# Altium schematic sheet ALS.SchDoc
size A
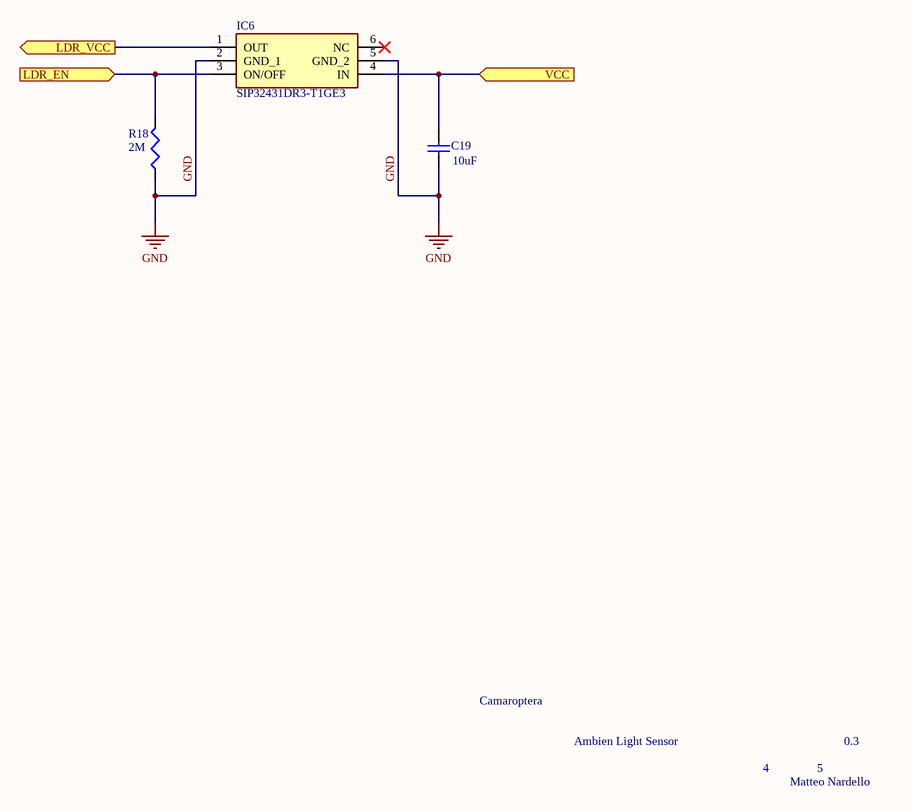
[diagram p0: ALS.SchDoc]

## Parts
C19  value 10uF  [1608[0603]]  (hidden comment: Cap)
IC6  SIP32431DR3-T1GE3  [SOT65P210X110-6N]
R18  value 2M  [J1-0603]  (hidden comment: Res3)

## Ports
LDR_EN (in), LDR_VCC (out), VCC (in)

## Nets
GND: C19.1 IC6.2(GND_1) IC6.5(GND_2) R18.1
LDR_EN: IC6.3(ON/OFF) R18.2 ; port LDR_EN
LDR_VCC: IC6.1(OUT) ; port LDR_VCC
VCC: C19.2 IC6.4(IN) ; port VCC

Not connected (* = marked no-connect by the designer): IC6 6(NC)*

## Notes on the sheet
- Camaroptera
- Ambien Light Sensor
- 4
- 5
- 0.3
- Matteo Nardello

## Library data of the parts
C19 = Cap: CAP CER 6.3V X5R/X7R 0603; PackageReference: 0603; Publisher: Altium Limited; PackageDescription: Chip Capacitor, Body 1.6x0.8mm, IPC High Density
IC6 = SIP32431DR3-T1GE3: 10 pA, Ultra Low Leakage and Quiescent Current, / Load Switch with Reverse Blocking; Manufacturer_Name: Vishay; Datasheet Link: https://componentsearchengine.com/Datasheets/1/SIP32431DR3-T1GE3.pdf; Height: 1.1mm; Mouser Part Number: 781-SIP32431DR3-GE3; Mouser Price/Stock: https://www.mouser.com/Search/Refine.aspx?Keyword=781-SIP32431DR3-GE3; Manufacturer_Part_Number: SIP32431DR3-T1GE3; ComponentLink1Description: Datasheet; ComponentLink1URL: https://www.vishay.com/docs/66597/sip32431.pdf; ComponentLink2Description: Package Specification; ComponentLink2URL: https://www.vishay.com/docs/71154/71154.pdf; ComponentLink3Description: Manufacturer URL; ComponentLink3URL: https://www.vishay.com
R18 = Res3: RES 1/10W 1% 0603 SMD; PackageReference: 0603; Publisher: Altium Limited; PackageDescription: Chip Resistor, Body 1.6x0.8mm, IPC High Density